# EAGLE design lower-board (EAGLE 6.6.0)
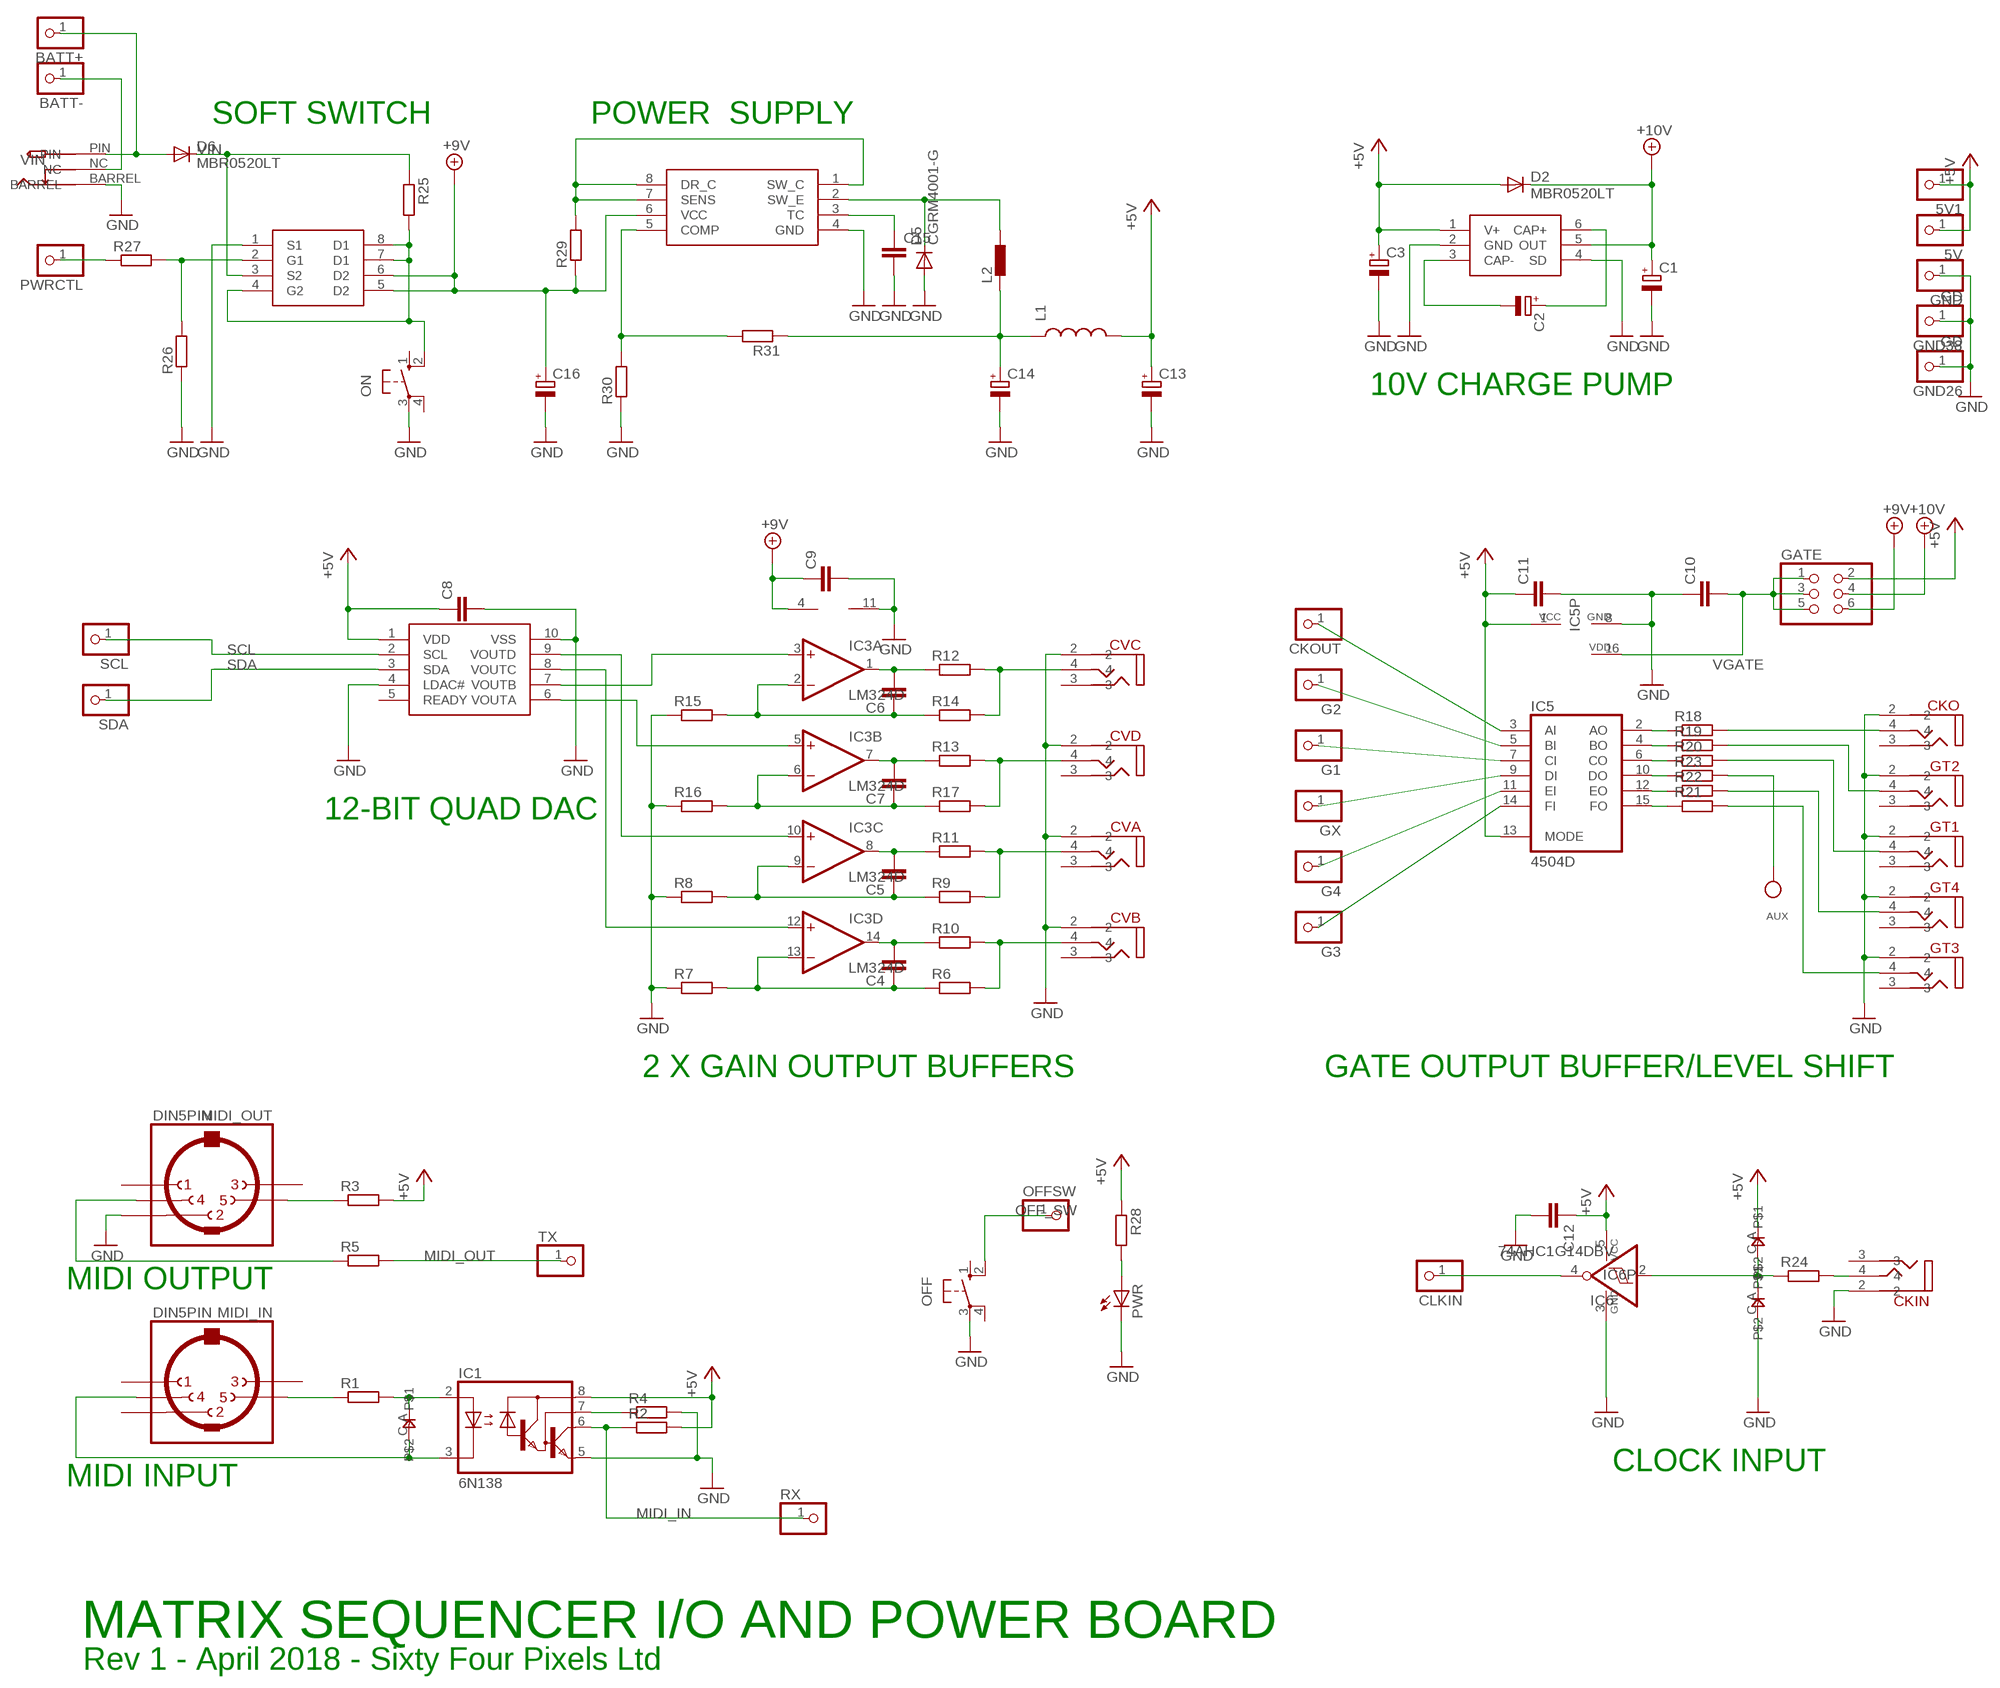
[diagram p0: schematic, sheet 1]

## Parts
5V  PINHD-1X1  [1X01]
5V1  PINHD-1X1  [1X01]
AUX  TESTPOINTROUND2MM  [TESTPOINT_ROUND_2MM]
BATT+  PINHD-1X1  [1X01]
BATT-  PINHD-1X1  [1X01]
C1  CPOL-EUSMCA  [SMC_A]
C2  CPOL-EUSMCA  [SMC_A]
C3  CPOL-EUSMCA  [SMC_A]
C4  C-EUC0805  [C0805]
C5  C-EUC0805  [C0805]
C6  C-EUC0805  [C0805]
C7  C-EUC0805  [C0805]
C8  C-EUC0805  [C0805]
C9  C-EUC0805  [C0805]
C10  C-EUC0805  [C0805]
C11  C-EUC0805  [C0805]
C12  C-EUC0805  [C0805]
C13  CPOL-EUE2.5-7  [E2,5-7]
C14  CPOL-EUE2.5-7  [E2,5-7]
C15  C-EUC0805  [C0805]
C16  CPOL-EUE2.5-7  [E2,5-7]
CKIN  VERTICAL_3_5MM_SOCKET  [VERTICAL_3_5MM_SOCKET]
CKO  VERTICAL_3_5MM_SOCKET  [VERTICAL_3_5MM_SOCKET]
CKOUT  PINHD-1X1  [1X01]
CLKIN  PINHD-1X1  [1X01]
CVA  VERTICAL_3_5MM_SOCKET  [VERTICAL_3_5MM_SOCKET]
CVB  VERTICAL_3_5MM_SOCKET  [VERTICAL_3_5MM_SOCKET]
CVC  VERTICAL_3_5MM_SOCKET  [VERTICAL_3_5MM_SOCKET]
CVD  VERTICAL_3_5MM_SOCKET  [VERTICAL_3_5MM_SOCKET]
D1  0805DIODE  [0805DIODE]
D2  MBR0520LT  [SOD123]
D3  0805DIODE  [0805DIODE]
D4  0805DIODE  [0805DIODE]
D5  CGRM4001-G  [SOD-123_MINI-SMA]
D6  MBR0520LT  [SOD123]
G1  PINHD-1X1  [1X01]
G2  PINHD-1X1  [1X01]
G3  PINHD-1X1  [1X01]
G4  PINHD-1X1  [1X01]
GATE  PINHD-2X3  [2X03]
GND  PINHD-1X1  [1X01]
GND26  GD  PINHD-1X1  [1X01]
GND38  GD  PINHD-1X1  [1X01]
GT1  VERTICAL_3_5MM_SOCKET  [VERTICAL_3_5MM_SOCKET]
GT2  VERTICAL_3_5MM_SOCKET  [VERTICAL_3_5MM_SOCKET]
GT3  VERTICAL_3_5MM_SOCKET  [VERTICAL_3_5MM_SOCKET]
GT4  VERTICAL_3_5MM_SOCKET  [VERTICAL_3_5MM_SOCKET]
GX  PINHD-1X1  [1X01]
IC1  6N138  [DIL08]
IC2  LM27675M5_CHARGEPUMP  [SOT23-6]
IC3  LM324D  [SO14]
IC4  MCP4728_QUAD_DAC  [MSOP10]
IC5  4504D  [SO16]
IC6  74AHC1G14DBV  [SOT23-5]
IC7  FDS8958B  [SOIC8]
IC8  SP34063A_BOOST_REG  [SOIC8]
L1  INDUCTOR1210  [1210]
L2  DR1030  [DR1030]
MIDI_IN  DIN5PIN  [EDGEDIN]
MIDI_OUT  DIN5PIN  [EDGEDIN]
OFF  10-XX  [B3F-10XX]
OFFSW  PINHD-1X1  [1X01]
ON  10-XX  [B3F-10XX]
PWR  LED3MM  [LED3MM]
PWRCTL  PINHD-1X1  [1X01]
R1  R-EU_R0805  [R0805]
R2  R-EU_R0805  [R0805]
R3  R-EU_R0805  [R0805]
R4  R-EU_R0805  [R0805]
R5  R-EU_R0805  [R0805]
R6  R-EU_R0805  [R0805]
R7  R-EU_R0805  [R0805]
R8  R-EU_R0805  [R0805]
R9  R-EU_R0805  [R0805]
R10  R-EU_R0805  [R0805]
R11  R-EU_R0805  [R0805]
R12  R-EU_R0805  [R0805]
R13  R-EU_R0805  [R0805]
R14  R-EU_R0805  [R0805]
R15  R-EU_R0805  [R0805]
R16  R-EU_R0805  [R0805]
R17  R-EU_R0805  [R0805]
R18  R-EU_R0805  [R0805]
R19  R-EU_R0805  [R0805]
R20  R-EU_R0805  [R0805]
R21  R-EU_R0805  [R0805]
R22  R-EU_R0805  [R0805]
R23  R-EU_R0805  [R0805]
R24  R-EU_R0805  [R0805]
R25  R-EU_R0805  [R0805]
R26  R-EU_R0805  [R0805]
R27  R-EU_R0805  [R0805]
R28  R-EU_R0805  [R0805]
R29  R-EU_R0805  [R0805]
R30  R-EU_R0805  [R0805]
R31  R-EU_R0805  [R0805]
RX  PINHD-1X1  [1X01]
SCL  PINHD-1X1  [1X01]
SDA  PINHD-1X1  [1X01]
TX  PINHD-1X1  [1X01]
U$1  PWR_SOCKET_2_1MM  [PWR_SOCKET_2_1MM]

## Nets
+5V: 5V1.1 5V.1 C3.+ C8.1 C11.1 C12.1 C13.+ D2.A D3.A GATE.2 IC1.8(VCC) IC2.1(V+) IC4.1(VDD) IC5.1(VCC) IC5.13(MODE) IC6.5(VCC) L1.2 R2.2 R3.2 R28.1
+9V: C9.1 C16.+ GATE.6 IC3.4(P:V+) IC7.5(D2) IC7.6(D2) IC8.6(VCC) R29.1
+10V: C1.+ D2.C GATE.4 IC2.5(OUT)
AUXGATE: GX.1 IC5.9(DI)
CLKIN: CLKIN.1 IC6.4(O)
CLKOUT: CKOUT.1 IC5.3(AI)
GATE1: G3.1 IC5.14(FI)
GATE2: G2.1 IC5.5(BI)
GATE3: G1.1 IC5.7(CI)
GATE4: G4.1 IC5.11(EI)
GND: C1.- C3.- C8.2 C9.2 C10.1 C11.2 C12.2 C13.- C14.- C15.2 C16.- CKIN.2 CKO.2 CVA.2 CVB.2 CVC.2 CVD.2 D4.C D5.A GND26.1 GND38.1 GND.1 GT1.2 GT2.2 GT3.2 GT4.2 IC1.5(GND) IC2.2(GND) IC2.4(SD) IC3.11(P:V-) IC4.4(LDAC#) IC4.10(VSS) IC5.8(GND) IC6.3(GND) IC7.1(S1) IC8.4(GND) MIDI_OUT.2 OFF.3(P) ON.3(P) PWR.K(C) R4.2 R7.1 R8.1 R15.1 R16.1 R26.1 R30.1 U$1.BARREL
MIDI_IN: IC1.6(VO) R2.1 RX.1
MIDI_OUT: R5.2 TX.1
N$1: MIDI_OUT.5 R3.1
N$2: D1.A IC1.2(A) R1.2
N$3: IC3.3(A:+IN) IC4.7(VOUTB)
N$4: D1.C IC1.3(C) MIDI_IN.4
N$5: IC1.7(VB) R4.1
N$6: MIDI_OUT.4 R5.1
N$7: MIDI_IN.5 R1.1
N$8: CVC.4 R12.2 R14.2
N$9: CVD.4 R13.2 R17.2
N$10: CVB.4 R6.2 R10.2
N$11: CVA.4 R9.2 R11.2
N$12: C6.2 IC3.1(A:OUT) R12.1
N$13: C7.2 IC3.7(B:OUT) R13.1
N$14: C5.2 IC3.8(C:OUT) R11.1
N$15: C4.2 IC3.14(D:OUT) R10.1
N$17: C4.1 IC3.13(D:-IN) R6.1 R7.2
N$18: C5.1 IC3.9(C:-IN) R8.2 R9.1
N$20: C7.1 IC3.6(B:-IN) R16.2 R17.1
N$22: C6.1 IC3.2(A:-IN) R14.1 R15.2
N$29: IC3.5(B:+IN) IC4.6(VOUTA)
N$30: IC3.10(C:+IN) IC4.9(VOUTD)
N$31: IC3.12(D:+IN) IC4.8(VOUTC)
N$32: IC8.1(SW_C) IC8.7(SENS) IC8.8(DR_C) R29.2
N$33: IC8.5(COMP) R30.2 R31.2
N$34: C15.1 IC8.3(TC)
N$35: D5.C IC8.2(SW_E) L2.2
N$36: BATT+.1 D6.A U$1.PIN
N$37: IC5.2(AO) R18.1
N$38: C2.+ IC2.6(CAP+)
N$39: C2.- IC2.3(CAP-)
N$40: IC5.4(BO) R19.1
N$41: IC5.6(CO) R20.1
N$42: IC5.10(DO) R23.1
N$43: IC5.12(EO) R22.1
N$44: CKO.4 R18.2
N$45: GT2.4 R19.2
N$46: GT1.4 R20.2
N$47: GT4.4 R22.2
N$48: GT3.4 R21.2
N$49: IC5.15(FO) R21.1
N$50: AUX.P$1 R23.2
N$51: C14.+ L1.1 L2.1 R31.1
N$53: D3.C D4.A IC6.2(I) R24.1
N$54: CKIN.4 R24.2
N$56: PWR.A R28.2
N$61: IC7.4(G2) IC7.7(D1) IC7.8(D1) ON.2(S1) R25.2
N$62: IC7.2(G1) R26.2 R27.2
N$71: BATT-.1 U$1.NC
OFF_SW: OFF.2(S1) OFFSW.1
PWR_CTRL: PWRCTL.1 R27.1
SCL: IC4.2(SCL) SCL.1
SDA: IC4.3(SDA) SDA.1
VGATE: C10.2 GATE.1 GATE.3 GATE.5 IC5.16(VDD)
VIN: D6.C IC7.3(S2) R25.1
Unconnected: CKIN.3 CKO.3 CVA.3 CVB.3 CVC.3 CVD.3 GT1.3 GT2.3 GT3.3 GT4.3 IC4.5(READY) MIDI_IN.1 MIDI_IN.2 MIDI_IN.3 MIDI_OUT.1 MIDI_OUT.3 OFF.1(S) OFF.4(P1) ON.1(S) ON.4(P1)

## Notes on the sheet
- SOFT SWITCH | POWER  SUPPLY
- 10V CHARGE PUMP
- 12-BIT QUAD DAC
- 2 X GAIN OUTPUT BUFFERS | GATE OUTPUT BUFFER/LEVEL SHIFT
- MIDI OUTPUT
- CLOCK INPUT
- MIDI INPUT
- MATRIX SEQUENCER I/O AND POWER BOARD
- Rev 1 - April 2018 - Sixty Four Pixels Ltd

## Library data of the parts
5V 5V1 BATT+ BATT- CKOUT CLKIN G1-G4 GND GND26 GND38 GX OFFSW PWRCTL RX SCL SDA TX = pinhead:PINHD-1X1: PIN HEADER
AUX = microbuilder:TESTPOINT: Test Point TESTPOINT_SMT - Compact Surface Mount Test Point [Digikey: 5016KTR-ND] TESTPOINT_PAD - Square Pad (2mm) TESTPOINT_SMT - Round Pad (2mm) TESTPOINT_0.1" - 0.1" Header
C1-C3 C13 C14 C16 = rcl:CPOL-EU: POLARIZED CAPACITOR, European symbol
C4-C12 C15 = rcl:C-EU: CAPACITOR, European symbol
CKIN CKO CVA CVB CVC CVD GT1-GT4 = jason_eagle6:VERTICAL_3_5MM_SOCKET
D1 D3 D4 = jasons_stuff:0805DIODE
D2 D6 = diode:MBR0520LT: SCHOTTKY BARRIER RECTIFIER Source: http://onsemi.com .. MBR0520LT1-D.pdf
D5 = diode:CGRM400*-G: Molded plasitc,JEDEC SOD-123/Mini SMA Source: Comchip CGRM4001-G.pdf
GATE = pinhead:PINHD-2X3: PIN HEADER
IC1 = optocoupler:6N138: MOTOROLA OPTO COUPLER; MF: VISHAY/TELEFUNKEN; MPN: 6N138; OC_FARNELL: 9860150; OC_NEWARK: 35K5294
IC2 = jason_eagle6:LM27675M5_CHARGEPUMP
IC3 = linear:LM324: OP AMP
IC4 = jason_eagle6:MCP4728_QUAD_DAC
IC5 = 45xx:4504: TTL or CMOS to CMOS hex LEVEL SHIFTER
IC6 = 74xx-little-de:74*1G14: Single Schmitt-Trigger Inverter Gate
IC7 = jason_eagle6:FDS8958B
IC8 = jason_eagle6:SP34063A_BOOST_REG
L1 = SparkFun:INDUCTOR: Inductors Basic Inductor/Choke - 0603 and 1206. Footprints are not proven and vary greatly between part numbers.
L2 = inductors:DR1030: DR1030 Series Low Profile Power Inductors Source: Data sheet <http://www.cooperbussmann.com/pdf/c73e479f-f867-4c64-ae26-9c1f23814163.pdf>
MIDI_IN MIDI_OUT = jason_eagle6:DIN5PIN: Female CONNECTOR 5 pins 90 deg. with shield, horizontal (DIN 41524)
OFF ON = switch-omron:10-XX: OMRON SWITCH; MPN: B3F-1000; OC_FARNELL: 176432; OC_NEWARK: 36M3542
PWR = led:LED: LED OSRAM: - CHIPLED LG R971, LG N971, LY N971, LG Q971, LY Q971, LO R971, LY R971 LH N974, LH R974 LS Q976, LO Q976, LY Q976 LO Q996 - Hyper CHIPLED LW Q18S LB Q993, LB Q99A, LB R99A - SideLED LS A670, LO A670, LY A670, LG A670, LP A670 LB A673, LV A673, LT A673, LW A673 LH A674 LY A675 LS A676, LA A676, LO A676, LY A676, LW A676 LS A679, LY A679, LG A679 - Hyper Micro SIDELED® LS Y876, LA Y876, LO Y876, LY Y876 LT Y87S - SmartLED LW L88C, LW L88S LB L89C, LB L89S, LG L890 LS L89K, LO L89K, LY L89K LS L896, LA L896, LO L896, LY L896 - TOPLED LS T670, LO T670, LY T670, LG T670, LP T670 LSG T670, LSP T670, LSY T670, LOP T670, LYG T670 LG T671, LOG T671, LSG T671 LB T673, LV T673, LT T673, LW T673 LH T674 LS T676, LA T676, LO T676, LY T676, LB T676, LH T676, LSB T676, LW T676 LB T67C, LV T67C, LT T67C, LS T67K, LO T67K, LY T67K, LW E67C LS E67B, LA E67B, LO E67B, LY E67B, LB E67C, LV E67C, LT E67C LW T67C LS T679, LY T679, LG T679 LS T770, LO T770, LY T770, LG T770, LP T770 LB T773, LV T773, LT T773, LW T773 LH T774 LS E675, LA E675, LY E675, LS T675 LS T776, LA T776, LO T776, LY T776, LB T776 LHGB T686 LT T68C, LB T68C - Hyper Mini TOPLED® LB M676 - Mini TOPLED Santana® LG M470 LS M47K, LO M47K, LY M47K Source: http://www.osram.convergy.de LUXEON: - LUMILED® LXK2-PW12-R00, LXK2-PW12-S00, LXK2-PW14-U00, LXK2-PW14-V00 LXK2-PM12-R00, LXK2-PM12-S00, LXK2-PM14-U00 LXK2-PE12-Q00, LXK2-PE12-R00, LXK2-PE12-S00, LXK2-PE14-T00, LXK2-PE14-U00 LXK2-PB12-K00, LXK2-PB12-L00, LXK2-PB12-M00, LXK2-PB14-N00, LXK2-PB14-P00, LXK2-PB14-Q00 LXK2-PR12-L00, LXK2-PR12-M00, LXK2-PR14-Q00, LXK2-PR14-R00 LXK2-PD12-Q00, LXK2-PD12-R00, LXK2-PD12-S00 LXK2-PH12-R00, LXK2-PH12-S00 LXK2-PL12-P00, LXK2-PL12-Q00, LXK2-PL12-R00 Source: www.luxeon.com KINGBRIGHT: KA-3528ASYC Source: www.kingbright.com
R1-R31 = rcl:R-EU_: RESISTOR, European symbol
U$1 = jason_eagle6:PWR_SOCKET_2_1MM

## Board
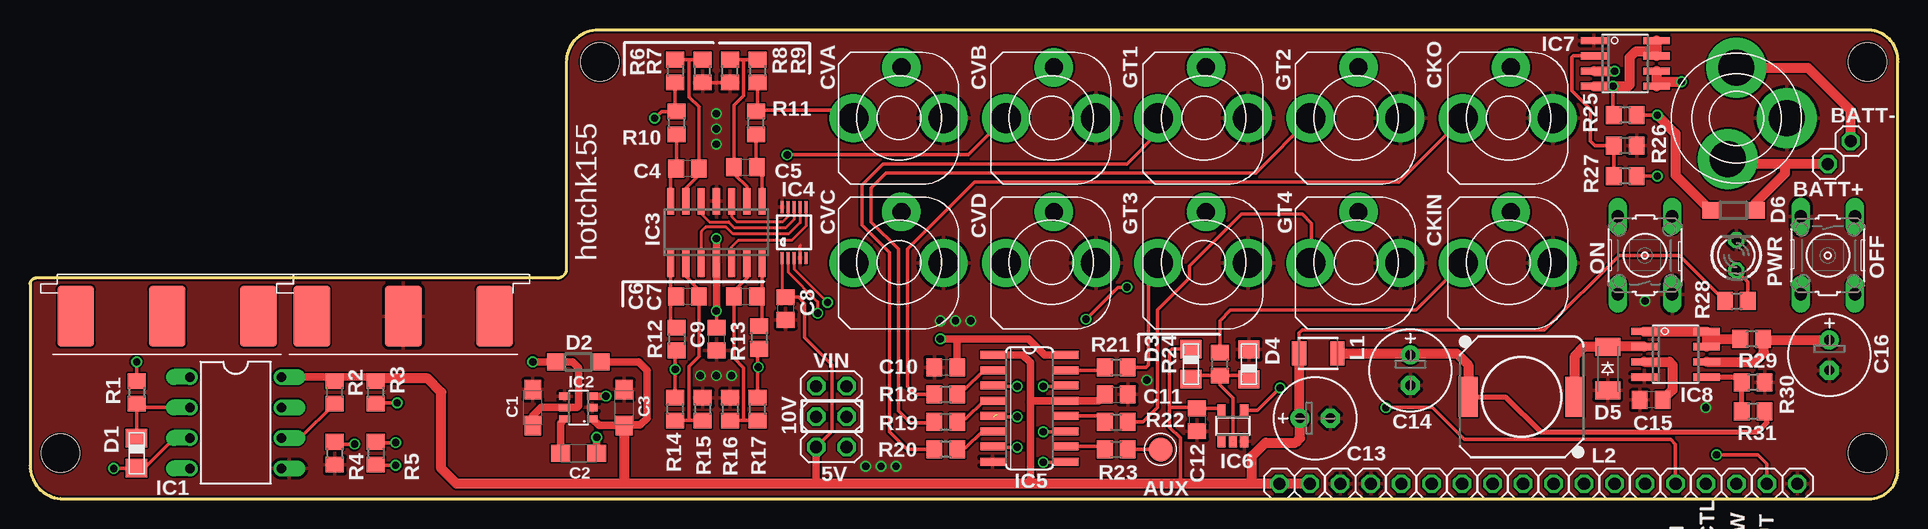
[diagram p1: board, top side]
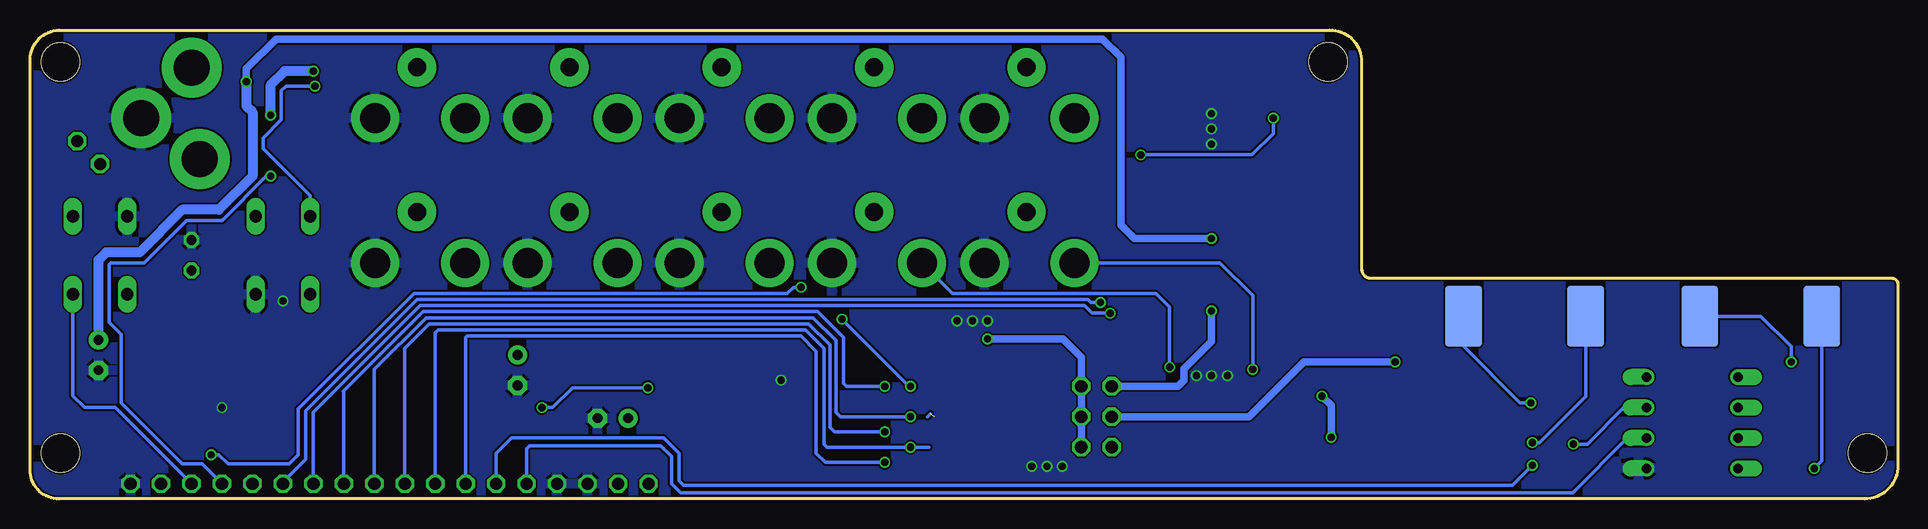
[diagram p2: board, bottom side, seen from below]

Size 155.7 x 39.12 mm. Coordinates in mm from the lower left corner, seen from the top.
Outline: 0,17.91 0,2.79 arc90 2.79,0 153.29,0 arc90 155.7,2.41 155.7,36.45 arc90 153.29,39.12 47.37,39.12 arc90 44.7,36.45 44.7,19.18 arc-90 43.94,18.41 0.51,18.41 arc90 0,17.91
Copper layers (1*16): Top 0.035mm / dielectric 1.5mm / Bottom 0.035mm
Design rules "hackvana": minimum track width 6mil, minimum drill 0.3mm, track to track 6mil, track to pad 9mil, pad to pad 6mil, via to via 6mil, smd to smd 0mil, copper to edge 6mil, drill to drill 6mil, minimum pad ring 10mil, minimum via ring 6mil, stop-mask expansion 2mil, vias tented up to drill 100mil, thermal gap 10mil
Holes 3.2 mm at 2.54,3.81 153.16,3.81 47.5,36.45 153.16,36.45

### Footprints (pad centres in the part's own frame; a part is rotated, then mirrored left to right if it is on the bottom)
1X01 = drill 1.016 octagon: 1 0,0
TESTPOINT_ROUND_2MM = smd 2 x 2: P$1 0,0
SMC_A = smd 1.6 x 1.4: + -1.5,0; - 1.5,0
C0805 = smd 1.3 x 1.5: 1 -0.95,0; 2 0.95,0
E2,5-7 = drill 0.813 pad 1.6: + -1.27,0 | drill 0.813 pad 1.6 octagon: - 1.27,0
VERTICAL_3_5MM_SOCKET = drill 2.5 pad 4: 2 0,-3.75; 4 0,3.75 | drill 1.5 pad 3.2: 3 4.25,-0.25
0805DIODE = smd 1.524 x 1.778: A -1.262,-0.005; C 1.238,-0.005
SOD123 = smd 1.4 x 1.4: A 1.9,0; C -1.9,0
SOD-123_MINI-SMA = smd 1.5 x 2.1: A 1.8,0; C -1.8,0
2X03 = drill 1.016 octagon: 1 -2.54,-1.27; 2 -2.54,1.27; 3 0,-1.27; 4 0,1.27; 5 2.54,-1.27; 6 2.54,1.27
DIL08 = drill 0.813 offset: 1 -3.81,-3.81; 2 -1.27,-3.81; 3 1.27,-3.81; 4 3.81,-3.81; 5 3.81,3.81; 6 1.27,3.81; 7 -1.27,3.81; 8 -3.81,3.81
SOT23-6 = smd 0.6 x 0.9: 1 -0.95,-1.15; 2 0,-1.15; 3 0.95,-1.15; 4 0.95,1.15; 5 0,1.15; 6 -0.95,1.15
SO14 = smd 0.6 x 2.2: 1 -3.81,-2.6; 2 -2.54,-2.6; 3 -1.27,-2.6; 4 0,-2.6; 5 1.27,-2.6; 6 2.54,-2.6; 7 3.81,-2.6; 8 3.81,2.6; 9 2.54,2.6; 10 1.27,2.6; 11 0,2.6; 12 -1.27,2.6; 13 -2.54,2.6; 14 -3.81,2.6
MSOP10 = smd 0.25 x 1: 1 -1,-2.113; 2 -0.5,-2.113; 3 0,-2.113; 4 0.5,-2.113; 5 1,-2.113; 6 1,2.113; 7 0.5,2.113; 8 0,2.113; 9 -0.5,2.113; 10 -1,2.113
SO16 = smd 0.66 x 2.032: 1 -4.445,-3.073; 2 -3.175,-3.073; 3 -1.905,-3.073; 4 -0.635,-3.073; 5 0.635,-3.073; 6 1.905,-3.073; 7 3.175,-3.073; 8 4.445,-3.073; 9 4.445,3.073; 10 3.175,3.073; 11 1.905,3.073; 12 0.635,3.073; 13 -0.635,3.073; 14 -1.905,3.073; 15 -3.175,3.073; 16 -4.445,3.073
SOT23-5 = smd 0.69 x 0.99: 1 -0.95,-1.29; 2 0,-1.29; 3 0.95,-1.29; 4 0.95,1.3; 5 -0.95,1.3
SOIC8 = smd 0.6 x 2.2: 1 -1.905,-2.6; 2 -0.635,-2.6; 3 0.635,-2.6; 4 1.905,-2.6; 5 1.905,2.6; 6 0.635,2.6; 7 -0.635,2.6; 8 -1.905,2.6
1210 = smd 1.2 x 2: 1 -1.6,0; 2 1.6,0
DR1030 = smd 3.3 x 1.6: 1 0,4.45; 2 0,-4.45
EDGEDIN = smd 3.048 x 5.08: 1 -7.62,-10.16; 2 0,-10.16; 3 7.62,-10.16 | smd 3.048 x 5.08 bottom: 4 -5.08,-10.16; 5 5.08,-10.16
B3F-10XX = drill 1.016 long: 1 -3.251,2.261; 2 3.251,2.261; 3 -3.251,-2.261; 4 3.251,-2.261
LED3MM = drill 0.813 octagon: A -1.27,0; K 1.27,0
R0805 = smd 1.3 x 1.5: 1 -0.95,0; 2 0.95,0
PWR_SOCKET_2_1MM = drill 3 pad 5: BARREL 0,4.2; NC -4.2,0; PIN 3.4,-0.7

### Placement (x,y rotation side)
5V  104.14,1.27 0 top
5V1  106.68,1.27 0 top
AUX  94.23,4.13 0 top
BATT+  149.86,27.94 0 top
BATT-  151.76,29.84 0 top
C1  41.91,7.62 90 top
C2  45.72,3.81 0 top
C3  49.53,7.62 90 top
C4  54.8,27.56 180 top
C5  59.63,27.69 0 top
C6  54.8,16.89 180 top
C7  59.63,16.89 0 top
C8  62.99,15.88 270 top
C9  57.21,13.34 270 top
C10  76.33,10.99 0 top
C11  90.55,8.7 0 top
C12  97.28,6.6 270 top
C13  107.12,6.73 0 top
C14  115.06,10.73 270 top
C15  135.13,8.26 180 top
C16  149.99,12 270 top
CKIN  123.19,19.68 90 top
CKO  123.19,31.75 90 top
CKOUT  144.78,1.27 90 top
CLKIN  137.16,1.27 90 top
CVA  72.39,31.75 90 top
CVB  85.09,31.75 90 top
CVC  72.39,19.68 90 top
CVD  85.09,19.68 90 top
D1  8.89,3.81 270 top
D2  45.72,11.43 0 top
D3  96.77,11.24 270 top
D4  101.6,11.24 90 top
D5  131.51,10.86 270 top
D6  141.99,24.07 0 top
G1  121.92,1.27 90 top
G2  127,1.27 90 top
G3  129.54,1.27 90 top
G4  124.46,1.27 90 top
GATE  66.8,6.86 90 top
GND  147.32,1.27 0 top
GND26  111.76,1.27 0 top
GND38  109.22,1.27 90 top
GT1  97.79,31.75 90 top
GT2  110.49,31.75 90 top
GT3  97.79,19.68 90 top
GT4  110.49,19.68 90 top
GX  119.38,1.27 90 top
IC1  17.14,6.35 270 top
IC2  45.72,7.62 90 top
IC3  57.21,22.23 0 top
IC4  63.69,22.23 0 top
IC5  83.31,7.56 270 top
IC6  100.27,6.1 0 top
IC7  132.97,36.32 270 top
IC8  137.16,12.06 270 top
L1  107.38,12.13 180 top
L2  124.33,8.51 90 top
MIDI_IN  11.43,25.4 0 top
MIDI_OUT  31.11,25.4 0 top
OFF  149.86,20.32 270 top
OFFSW  142.24,1.27 0 top
ON  134.62,20.32 90 top
PWR  142.24,20.32 90 top
PWRCTL  139.7,1.27 90 top
R1  8.89,8.89 270 top
R2  25.4,8.89 90 top
R3  28.83,8.89 90 top
R4  25.4,3.81 270 top
R5  28.83,3.81 270 top
R6  53.78,35.69 270 top
R7  56.07,35.69 90 top
R8  58.36,35.69 90 top
R9  60.64,35.69 270 top
R10  53.91,31.37 90 top
R11  60.52,31.37 90 top
R12  53.91,13.34 270 top
R13  60.77,13.46 270 top
R14  53.78,7.49 90 top
R15  56.07,7.49 270 top
R16  58.36,7.49 270 top
R17  60.64,7.49 90 top
R18  76.33,8.7 180 top
R19  76.33,6.41 180 top
R20  76.33,4.13 180 top
R21  90.55,10.99 0 top
R22  90.55,6.41 0 top
R23  90.55,4.13 0 top
R24  99.19,11.24 90 top
R25  132.97,32 180 top
R26  132.97,29.46 180 top
R27  132.97,26.92 180 top
R28  142.24,16.51 0 top
R29  143.51,13.34 180 top
R30  143.64,9.72 180 top
R31  143.64,7.3 180 top
RX  114.3,1.27 90 top
SCL  132.08,1.27 90 top
SDA  134.62,1.27 90 top
TX  116.84,1.27 90 top
U$1  142.24,31.75 270 top

### Tracks (layer width: path | path; a pad name or v marks a point on that pad's centre or on a via)
+5V
  Top 0.254: IC4.1 62.69,17.13
  Top 0.305: 25.4,10.16 R2.2 25.46,9.84 25.78,10.16 | IC6.5 99.16,7.55 C12.1 96.71,7.62 95,7.62 | L1.2 105.78,13.83 106.05,14.1 126.24,14.1 132.46,20.32 137.48,20.32 R28.1 | D3.A 95.18,12.5 95,12.32 95,7.62 | 95,7.62 95,5.97 95.89,5.08 95.89,1.4 96.01,1.27 | 62.69,17.13 C8.1 64.07,16.83 64.58,16.32 64.58,13.46 66.87,11.18 66.87,5.65 GATE.2
  Top 0.61: IC1.8 25.08,10.16 R2.2 | 25.78,10.16 28.51,10.16 R3.2 28.83,10.03 28.96,10.16 | IC5.1 82.74,12 83.38,11.37 83.38,8.06 | 83.38,8.06 83.38,1.52 83.12,1.27 | 83.38,8.06 83.5,8.19 IC5.13 89.09,8.19 C11.1 | IC2.1 47.42,6.12 C3.+ 49.57,6.16 50.86,6.16 51.43,6.73 51.43,10.73 50.74,11.43 D2.A | GATE.2 65.53,1.52 65.28,1.27
  Top 0.813: 5V1.1 5V.1 | 5V.1 96.01,1.27 83.12,1.27 65.28,1.27 49.53,1.27 | 5V.1 102.11,1.27 101.85,1.52 101.85,3.56 103,4.7 105.47,4.7 105.85,5.08 C13.+ 105.78,6.81 L1.2 | 49.53,1.27 35.56,1.27 34.29,2.54 34.29,8.89 33.15,10.03 29.02,10.03 R3.2 | C3.+ 49.53,1.27
+9V  (via drill 0.6, 0.6 pad 0.3, 0.6 pad 0.61)
  Top 0.305: C9.1 v57.21,15.68
  Top 0.61: v57.21,15.68 IC3.4 v57.21,21.72
  Top 0.813: IC7.6 IC7.5 135.57,34.73 135.64,34.8 v137.67,34.8 | 144.53,13.27 144.53,12.19 143.76,11.43 IC8.6 | 144.53,13.27 R29.1 | 144.53,13.27 C16.+
  Bottom 0.61: v57.21,15.68 57.21,13.14 59.5,10.86 59.5,9.91 60.01,9.4 GATE.6 | v137.67,34.8 137.67,35.88 135.19,38.35 66.29,38.35 64.77,36.83 64.77,22.86 63.63,21.72 v57.21,21.72
  Bottom 0.813: v137.67,34.8 137.67,32.77 137.16,32.26 137.16,26.92 139.95,24.13 143,24.13 146.56,20.57 149.35,20.57 149.99,19.94 C16.+
+10V  (via drill 0.6 pad 0.81)
  Top 0.61: v41.91,11.43 D2.C 45.21,11.43 45.72,10.92 45.72,7.75 45.59,7.62 IC2.5 42.61,7.62 41.91,6.92 C1.+
  Bottom 0.61: v41.91,11.43 49.53,11.43 54.1,6.86 GATE.4
AUXGATE  (via drill 0.6 pad 0.3)
  Top 0.305: v84.45,3.05 86.32,3.05 IC5.9
  Bottom 0.305: GX.1 119.38,13.46 119.25,13.59 91.44,13.59 90.17,12.32 90.17,3.81 89.41,3.05 v84.45,3.05
CLKIN  (via drill 0.6 pad 0.3)
  Top 0.305: CLKIN.1 137.16,4.57 136.78,4.95 119.57,4.95 116.9,7.62 v113.03,7.62 | IC6.4 102.33,7.4 v104.2,9.27
  Bottom 0.305: v104.2,9.27 110.49,9.27 112.14,7.62 v113.03,7.62
CLKOUT  (via drill 0.6 pad 0.3)
  Top 0.305: CKOUT.1 144.78,2.92 144.02,3.68 v140.59,3.68 | v82.3,9.4 80.3,9.4 IC5.3 | v88.01,14.99 90.68,17.65 v91.44,17.65
  Bottom 0.305: v82.3,9.4 82.42,9.4 v88.01,14.99 | v91.44,17.65 92.08,17.65 92.58,17.14 123.7,17.14 133.35,7.49 133.35,3.68 134.11,2.92 139.19,2.92 139.95,3.68 v140.59,3.68
GATE1  (via drill 0.6 pad 0.3)
  Top 0.305: v84.45,9.4 86.32,9.4 IC5.14
  Bottom 0.305: G3.1 129.54,8.89 129.6,8.95 122.94,15.62 90.04,15.62 87.88,13.46 87.88,9.65 87.63,9.4 v84.45,9.4
GATE2  (via drill 0.6 pad 0.3)  (1 unrouted)
  Top 0.305: v82.3,6.86 80.3,6.86 IC5.5
  Bottom 0.305: 80.9,6.86 80.65,7.11 | G2.1 127,10.79 122.68,15.11 90.42,15.11 88.52,13.21 88.52,7.24 88.14,6.86 v82.3,6.86
GATE3  (via drill 0.6 pad 0.3)
  Top 0.305: v82.3,4.32 80.3,4.32 IC5.7
  Bottom 0.305: 80.77,4.32 v82.3,4.32 89.28,4.32 89.54,4.57 89.54,12.57 91.06,14.1 121.67,14.1 121.92,13.84 G1.1
GATE4  (via drill 0.6 pad 0.3)
  Top 0.305: v84.45,5.59 86.32,5.59 IC5.11
  Bottom 0.305: G4.1 124.46,12.57 122.43,14.61 90.81,14.61 89.03,12.83 89.03,5.97 88.65,5.59 v84.45,5.59
GND  (via drill 0.6, 0.6 pad 0.3)
  Top 0.254: IC4.4 64.19,21.14 64.2,21.14
  Top 0.305: R7.1 57.15,34.74 | 57.15,34.74 R8.1 | 57.21,34.67 57.15,34.74
  other vias: 55.88,10.29 134.62,16.51 139.7,7.62 93.09,9.91 75.88,14.86 77.15,14.86 78.42,14.86 72.2,2.73 69.66,2.73 70.93,2.73 57.21,29.59 57.21,30.86 57.21,32.13 57.21,10.29 58.48,10.29
  pour Bottom: -5.08,44.45 -5.08,-6.35 161.29,-6.35 161.29,43.18 0,43.18 0,45.72 -5.08,45.72
  pour Top: -8.89,50.8 -8.89,-10.16 161.29,-10.16 161.29,54.61 -8.89,54.61
MIDI_IN
  Top 0.305: IC1.6 22.54,5.08 R2.1
  Bottom 0.305: IC1.6 22.54,5.08 27.11,0.51 101.47,0.51 102.23,1.27 102.23,3.56 103.12,4.45 114.05,4.45 114.3,4.19 RX.1
MIDI_OUT  (via drill 0.6 pad 0.3)
  Top 0.305: v30.48,2.79 28.89,2.79 R5.2
  Bottom 0.305: v30.48,2.79 32.13,1.14 101.22,1.14 101.6,1.52 101.6,3.81 102.87,5.08 115.57,5.08 116.84,3.81 TX.1
N$1  (via drill 0.6)
  Top 0.305: v30.61,8 28.89,8 R3.1
  Bottom 0.305: MIDI_OUT.5 36.45,14.99 36.45,14.61 36.2,14.35 36.2,12.7 31.5,8 v30.61,8
N$2
  Top 0.305: IC1.2 9.21,7.62 R1.2 D1.A
N$3
  Top 0.254: IC4.7 64.19,23.04 63.25,22.1 58.61,22.1 58.04,22.67 56.32,22.67 55.94,22.29 IC3.3
N$4  (via drill 0.6)
  Top 0.305: IC1.3 12.07,5.08 9.53,2.54 8.92,2.54 | 8.92,2.54 D1.C | v6.99,2.54 8.92,2.54
  Bottom 0.305: MIDI_IN.4 6.35,3.17 v6.99,2.54
N$5  (via drill 0.6)
  Top 0.305: v27.05,4.57 25.59,4.57 R4.1
  Bottom 0.305: v27.05,4.57 25.91,4.57 22.86,7.62 IC1.7
N$6  (via drill 0.6)
  Top 0.305: v30.48,4.7 28.89,4.7 R5.1
  Bottom 0.305: MIDI_OUT.4 26.04,8.57 29.91,4.7 v30.48,4.7
N$7  (via drill 0.6)
  Top 0.305: R1.1 v8.89,11.43
  Bottom 0.305: v8.89,11.43 8.89,12.7 11.43,15.24 MIDI_IN.5
N$8  (via drill 0.6)
  Top 0.305: R14.2 v53.78,10.79 53.78,12.26 | 53.78,12.26 R12.2 53.85,12.38 53.78,12.32 53.78,12.26
  Bottom 0.305: CVC.4 56.51,19.68 53.78,16.95 v53.78,10.79
N$9  (via drill 0.6 pad 0.3)
  Top 0.305: R17.2 60.64,11.24 | R13.2 60.64,12.38 60.64,11.24 | 60.64,11.24 v60.71,10.99
  Bottom 0.305: 60.71,11.75 v60.71,10.99 60.71,16 61.85,17.14 78.8,17.14 CVD.4
N$10  (via drill 0.6, 0.6 pad 0.25)
  Top 0.305: R6.2 53.78,32.45 R10.2 52.64,32.32 v52.07,31.75 | CVB.4 81.28,31.75 78.23,28.7 v63.12,28.7
  Bottom 0.305: v52.07,31.75 52.07,30.48 53.85,28.7 v63.12,28.7
N$11
  Top 0.305: R9.2 60.64,32.45 | 60.64,32.45 R11.2 | 60.64,32.45 67.94,32.45 CVA.4
N$12
  Top 0.305: IC3.1 53.4,17.34 | 53.4,17.34 C6.2 | R12.1 53.85,14.29 53.4,14.73 53.4,17.34
N$13
  Top 0.305: IC3.7 61.02,17.34 C7.2 60.9,16.89 61.02,16.76 61.02,14.67 R13.1
N$14
  Top 0.305: IC3.8 61.02,27.24 C5.2 60.51,27.75 R11.1
N$15
  Top 0.305: IC3.14 53.4,27.11 C4.2 | C4.2 53.66,27.56 | R10.1 53.91,27.62 C4.2
N$17
  Top 0.305: IC3.13 54.67,25.91 55.69,26.92 55.69,27.5 C4.1 55.75,32.7 54.93,33.53 54.93,36.64 | R6.1 54.93,36.64 | 54.93,36.64 R7.2
N$18
  Top 0.305: IC3.9 59.75,26.04 58.74,27.05 58.74,27.62 C5.1 58.68,32.83 59.5,33.66 59.5,36.51 59.37,36.64 | R9.1 59.37,36.64 | 59.37,36.64 R8.2
N$20
  Top 0.305: IC3.6 59.75,18.41 58.74,17.4 58.74,16.95 C7.1 58.68,11.74 59.5,10.92 59.5,6.73 59.69,6.54 | R17.1 59.69,6.54 | 59.69,6.54 R16.2
N$22
  Top 0.305: IC3.2 54.67,18.54 55.69,17.53 55.69,17.08 C6.1 55.75,11.87 54.93,11.05 54.93,6.61 54.99,6.54 | R15.2 54.99,6.54 | 54.99,6.54 R14.1
N$29
  Top 0.254: IC4.6 64.69,22.78 63.5,21.59 59.05,21.59 58.48,21.02 IC3.5
N$30
  Top 0.254: IC4.9 63.19,23.57 62.74,23.11 58.93,23.11 58.48,23.56 IC3.10
N$31
  Top 0.254: IC4.8 63.69,23.3 62.99,22.61 58.74,22.61 58.23,23.11 56.64,23.11 55.94,23.81 IC3.12
N$32
  Top 0.813: IC8.8 IC8.7 | IC8.8 140.39,13.34 R29.2 | IC8.1 IC8.8
N$33
  Top 0.406: R31.2 R30.2 142.24,10.16 IC8.5
N$34
  Top 0.813: IC8.3 136.65,11.43 136.91,11.18 136.91,9.08 C15.1
N$35
  Top 0.813: IC8.2 131.47,12.7 | 131.47,12.7 130.81,12.7 129.54,12.7 128.78,11.94 L2.2 | 131.47,12.7 D5.C
N$36
  Top 0.813: BATT+.1 146.56,27.94 | 146.56,27.94 141.95,27.94 U$1.PIN | D6.A 143.89,24.76 146.3,27.18 146.3,27.69 146.56,27.94
N$37
  Top 0.305: IC5.2 79.5,10.73 77.85,9.08 77.66,9.08 R18.1
N$38
  Top 0.61: C2.+ 44.22,6.32 IC2.6
N$39  (via drill 0.6)
  Top 0.61: C2.- 47.22,5.12 v47.24,5.14 | v48.01,8.57 IC2.3
  Bottom 0.61: v47.24,5.14 47.24,7.81 v48.01,8.57
N$40
  Top 0.305: IC5.4 79.5,8.19 77.98,6.67 77.53,6.67 R19.1
N$41
  Top 0.305: IC5.6 79.38,5.65 77.98,4.25 77.4,4.25 R20.1
N$42
  Top 0.305: IC5.10 89.6,4.38 R23.1
N$43
  Top 0.305: IC5.12 89.35,6.92 R22.1
N$44
  Top 0.305: R18.2 73.85,8.7 73.15,9.4 73.15,20.83 78.74,26.42 114.11,26.42 CKO.4
N$45
  Top 0.305: R19.2 75.31,6.35 73.41,6.35 72.39,7.37 72.39,20.83 70.1,23.11 70.1,25.91 71.37,27.18 102.17,27.18 GT2.4
N$46
  Top 0.305: R20.2 73.09,4.13 71.63,5.59 71.63,20.57 69.34,22.86 69.34,26.16 71.12,27.94 91.44,27.94 94.04,30.54 GT1.4
N$47
  Top 0.305: R22.2 92.77,6.41 93.98,7.62 93.98,15.75 96.65,18.41 96.65,19.43 100.97,23.75 106.05,23.75 106.81,22.99 106.81,19.75 GT4.4
N$48
  Top 0.305: R21.2 93.03,10.99 93.22,11.18 93.22,18.86 GT3.4
N$49
  Top 0.305: IC5.15 89.35,10.73 R21.1
N$50
  Top 0.305: R23.2 AUX.P$1
N$51
  Top 0.406: R31.1 144.78,7.11 144.78,6.35 144.02,5.59 125.92,5.59 123,8.51 L2.1 119.88,9.27 119.89,9.27
  Top 0.813: 119.89,9.27 119.89,11.18 118.94,12.13 114.94,12.13 | L1.1 114.94,12.13 | 114.94,12.13 C14.+
N$53
  Top 0.305: R24.1 97.06,10.29 D3.C | R24.1 101.29,10.29 D4.A | R24.1 99.19,9.53 100.27,8.45 IC6.2
N$54
  Top 0.305: R24.2 99.19,14.86 100.08,15.75 115.5,15.75 CKIN.4
N$56
  Top 0.305: R28.2 143.19,18.1 PWR.A
N$61  (via drill 0.6 pad 0.3)
  Top 0.305: 131.95,32.07 131.95,34.04 132.21,34.42
  Top 0.813: IC7.7 IC7.8 134.93,37.34 133.86,37.34 133.35,36.83 133.35,34.54 133.22,34.42 132.21,34.42 v131.95,34.42 IC7.4 | 131.95,32.07 R25.2
  Bottom 0.305: ON.2 132.36,25.3 136.27,29.21 136.27,30.1 134.75,31.62 134.75,34.04 134.37,34.42 v131.95,34.42
N$62
  Top 0.305: IC7.2 128.65,36.96 128.52,36.83 128.52,34.04 130.05,32.51 130.05,29.84 130.43,29.46 R26.2 R27.2
N$71
  Top 0.813: U$1.NC 148.2,35.95 151.76,32.38 BATT-.1
OFF_SW
  Bottom 0.305: OFF.2 152.12,8.61 151.13,7.62 148.59,7.62 OFFSW.1
PWR_CTRL  (via drill 0.6 pad 0.3)
  Top 0.305: v135.64,26.92 R27.1
  Bottom 0.305: v135.64,26.92 136.02,26.92 139.7,23.24 142.62,23.24 146.18,19.68 148.97,19.68 149.1,19.56 149.1,14.73 148.08,13.72 148.08,8 143,2.92 141.35,2.92 PWRCTL.1
SCL  (via drill 0.6 pad 0.3)
  Top 0.254: IC4.2 63.19,18.91 65.66,16.45 v65.66,15.49
  Bottom 0.305: v65.66,15.49 67.18,15.49 67.82,16.13 123.19,16.13 132.08,7.24 SCL.1
SDA  (via drill 0.6 pad 0.3)
  Top 0.254: IC4.3 63.69,19.18 v66.48,16.38
  Bottom 0.305: SDA.1 134.62,1.4 132.72,3.3 132.72,7.37 123.44,16.64 67.5,16.64 67.25,16.38 v66.48,16.38
VGATE  (via drill 0.6 pad 0.81)
  Top 0.61: IC5.16 84.58,12 83.25,13.34 77.47,13.34 | 77.47,13.34 v75.88,13.34 | C10.2 77.28,13.14 77.47,13.34
  Bottom 0.61: v75.88,13.34 69.6,13.34 68.07,11.81 GATE.5 GATE.3 GATE.1
VIN  (via drill 0.6 pad 0.3)
  Top 0.305: R25.1 v135.64,32
  Top 0.813: v135.64,32 137.16,30.48 137.16,26.99 D6.C | IC7.3 v132.08,35.69
  Bottom 0.813: v135.64,32 135.64,34.54 134.49,35.69 v132.08,35.69

### Text on the board
tPlace: hotchk155 | VIN | 10V | 5V
bDocu: matrix synth i/o board rev 1